# Altium project IoT_Hardware.PrjPcb
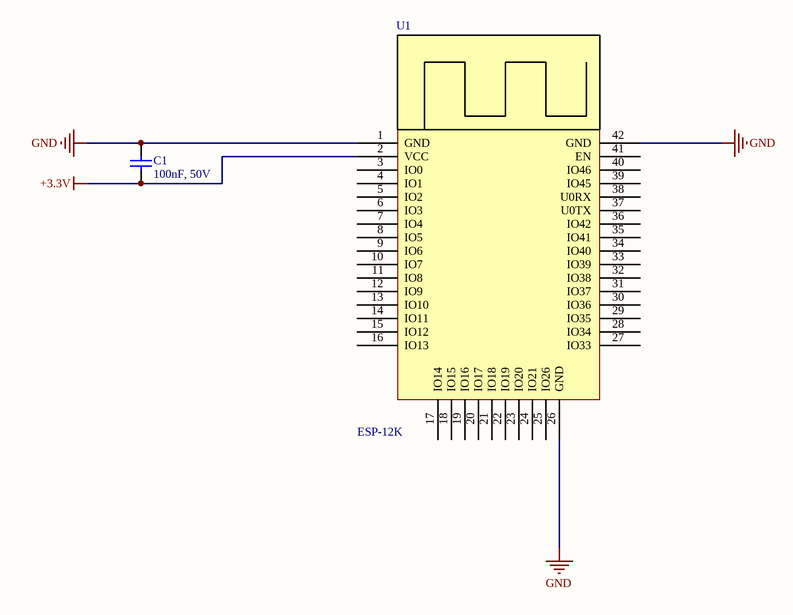
[diagram p0: 03_01_MCU_ESP32_Interface.SchDoc]
7 sheets, 51 parts. Net scope: flat (ports and power ports of the same name join across sheets).
Board file: v1.0.PcbDoc
Sheets:
  03_Top.SchDoc
  03_01_MCU_ESP32_Interface.SchDoc
  03_02_MCU_STM32F4_Interface.SchDoc
  04_Ethernet_Interface.SchDoc
  05_UART_Interface.SchDoc
  06_Power_Supply.SchDoc
  07_IO.SchDoc

## Sheet 03_Top.SchDoc
size A4; SheetNumber: 3; SheetTotal: 7

## Sheet 03_01_MCU_ESP32_Interface.SchDoc
size A4; SheetNumber: 4; SheetTotal: 9

### Parts
C1  100nF, 50V  [WCAP-CSGP_0603_H=0.8mm_Reflow]
U1  ESP-12K  [CAC-150P3100X1800-41N]

### Nets
+3.3V: C1.1 U1.2(VCC)
GND: C1.2 U1.1(GND) U1.26(GND) U1.42(GND)

Not connected (* = marked no-connect by the designer): U1 3(IO0) 4(IO1) 5(IO2) 6(IO3) 7(IO4) 8(IO5) 9(IO6) 10(IO7) 11(IO8) 12(IO9) 13(IO10) 14(IO11) 15(IO12) 16(IO13) 17(IO14) 18(IO15) 19(IO16) 20(IO17) 21(IO18) 22(IO19) 23(IO20) 24(IO21) 25(IO26) 27(IO33) 28(IO34) 29(IO35) 30(IO36) 31(IO37) 32(IO38) 33(IO39) 34(IO40) 35(IO41) 36(IO42) 37(U0TX) 38(U0RX) 39(IO45) 40(IO46) 41(EN)

### Library data of the parts
C1 = 885012206095: WCAP-CSGP Multilayer Ceramic Chip Capacitor, General Purpose, size 0603, X7R, 100nF, 50V; Manufacturer: Wurth Elektronik; Rated Voltage: 50VDC; Isolation Resistance: >=5GOhm; Capacitance Tolerance: +/-10%; Technical Reference: X7R0603104K050DFCT10000; ComponentLink1Description: Manufacturer; ComponentLink1URL: http://www.we-online.de; ComponentLink2Description: Datasheet; ComponentLink2URL: https://www.we-online.com/catalog/datasheet/885012206095.pdf; Operating Temperature: -55 to +125degC; Packaging: Tape and Reel; Manufacturer Part Number: 885012206095; Published Date: May 2020; Ceramic Type: X7R; Dissipation Factor: =<3%; Height: 0.8mm; Mounting Technology: SMT; Size: 0603; Capacitance: 100nF
U1 = ESP-12K: ESP32-S2

## Sheet 03_02_MCU_STM32F4_Interface.SchDoc
size A4; SheetNumber: 5; SheetTotal: 9
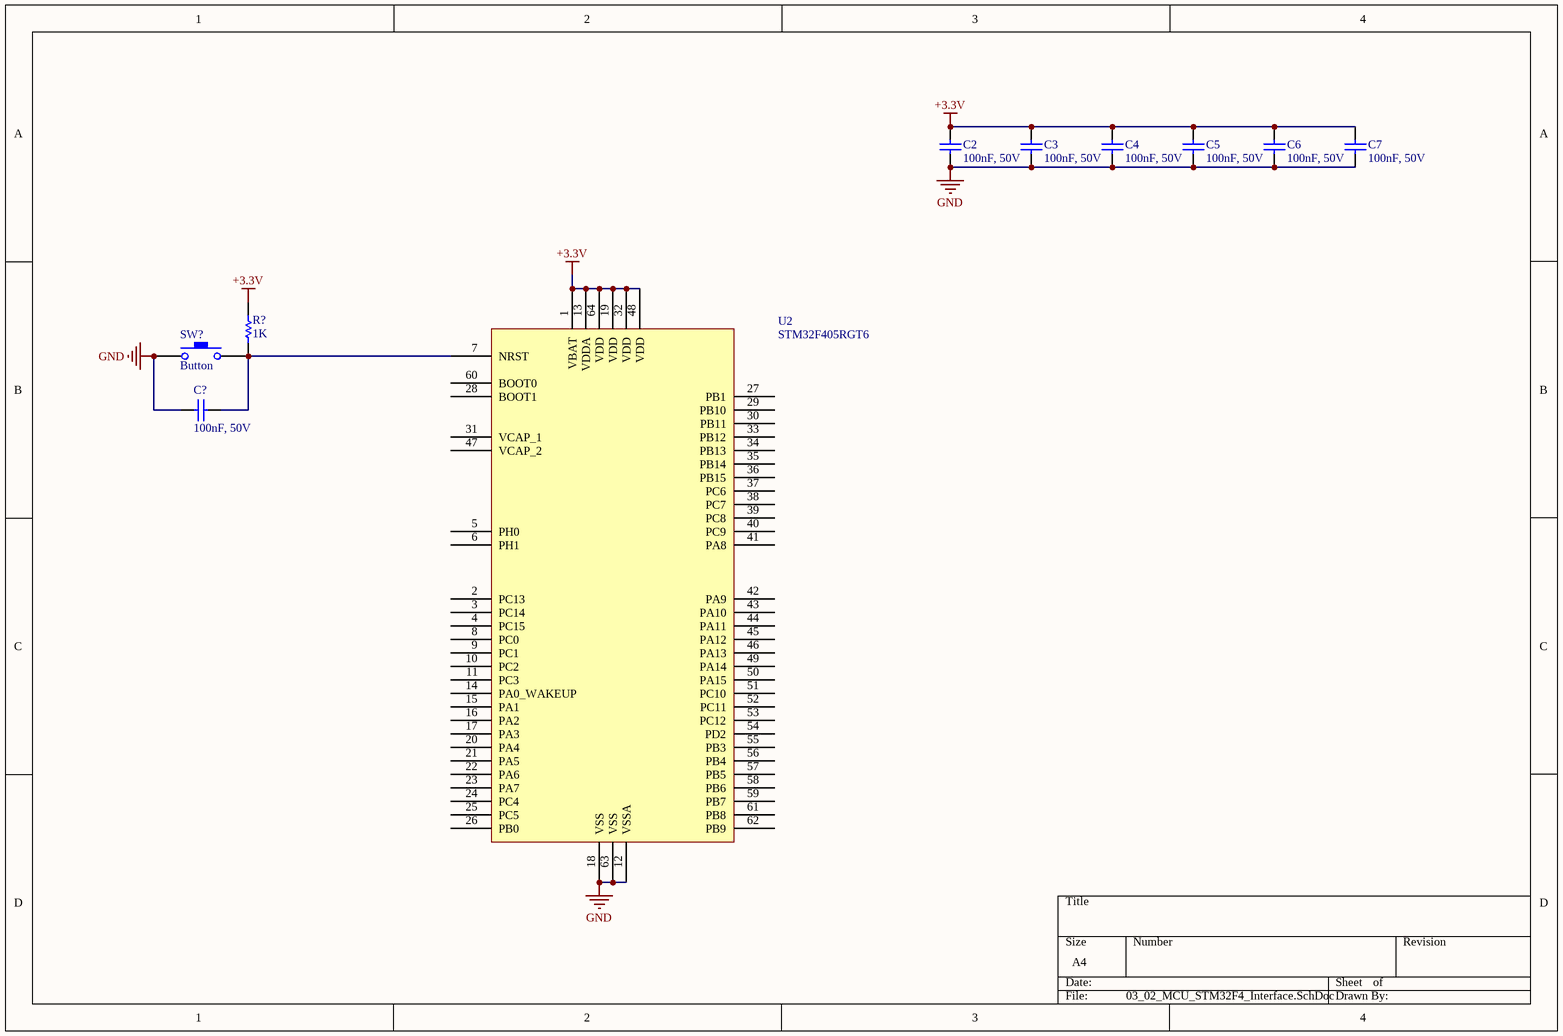
[diagram p1: 03_02_MCU_STM32F4_Interface.SchDoc]

### Parts
C2  100nF, 50V  [WCAP-CSGP_0603_H=0.8mm_Reflow]
C3  100nF, 50V  [WCAP-CSGP_0603_H=0.8mm_Reflow]
C4  100nF, 50V  [WCAP-CSGP_0603_H=0.8mm_Reflow]
C5  100nF, 50V  [WCAP-CSGP_0603_H=0.8mm_Reflow]
C6  100nF, 50V  [WCAP-CSGP_0603_H=0.8mm_Reflow]
C7  100nF, 50V  [WCAP-CSGP_0603_H=0.8mm_Reflow]
C?  100nF, 50V  [WCAP-CSGP_0603_H=0.8mm_Reflow]
R?  value 1K  [RES-SM-0603]  (hidden comment: RESISTOR SMD)
SW?  Button  [Button 4-pin SMD]
U2  STM32F405RGT6  [CQFP50P1150X1150X160-64N]

### Nets
+3.3V: C2.2 C3.2 C4.2 C5.2 C6.2 C7.2 R?.2 U2.1(VBAT) U2.13(VDDA) U2.19(VDD) U2.32(VDD) U2.48(VDD) U2.64(VDD)
GND: C2.1 C3.1 C4.1 C5.1 C6.1 C7.1 C?.1 SW?.1 U2.12(VSSA) U2.18(VSS) U2.63(VSS)
NetC?_2: C?.2 R?.1 SW?.2 U2.7(NRST)

Not connected (* = marked no-connect by the designer): U2 2(PC13) 3(PC14) 4(PC15) 5(PH0) 6(PH1) 8(PC0) 9(PC1) 10(PC2) 11(PC3) 14(PA0_WAKEUP) 15(PA1) 16(PA2) 17(PA3) 20(PA4) 21(PA5) 22(PA6) 23(PA7) 24(PC4) 25(PC5) 26(PB0) 27(PB1) 28(BOOT1) 29(PB10) 30(PB11) 31(VCAP_1) 33(PB12) 34(PB13) 35(PB14) 36(PB15) 37(PC6) 38(PC7) 39(PC8) 40(PC9) 41(PA8) 42(PA9) 43(PA10) 44(PA11) 45(PA12) 46(PA13) 47(VCAP_2) 49(PA14) 50(PA15) 51(PC10) 52(PC11) 53(PC12) 54(PD2) 55(PB3) 56(PB4) 57(PB5) 58(PB6) 59(PB7) 60(BOOT0) 61(PB8) 62(PB9)

### Library data of the parts
C2-C7 C? = 885012206095: as C1 on sheet 03_01_MCU_ESP32_Interface; ComponentLink1Description: Manufacturer; ComponentLink1URL: http://www.we-online.de; ComponentLink2Description: Datasheet; ComponentLink2URL: https://www.we-online.com/catalog/datasheet/885012206095.pdf; Operating Temperature: -55 to +125degC; Packaging: Tape and Reel; Manufacturer Part Number: 885012206095; Published Date: May 2020; Ceramic Type: X7R; Dissipation Factor: =<3%; Height: 0.8mm; Mounting Technology: SMT; Size: 0603; Capacitance: 100nF
R? = RESISTOR SMD: Resistor
U2 = STM32F405RGT6: Manufacturer: ST; ComponentLink1Description: Supplier 1 Link

## Sheet 04_Ethernet_Interface.SchDoc
size A4; SheetNumber: 4; SheetTotal: 7

## Sheet 05_UART_Interface.SchDoc
size A4; SheetNumber: 7; SheetTotal: 9
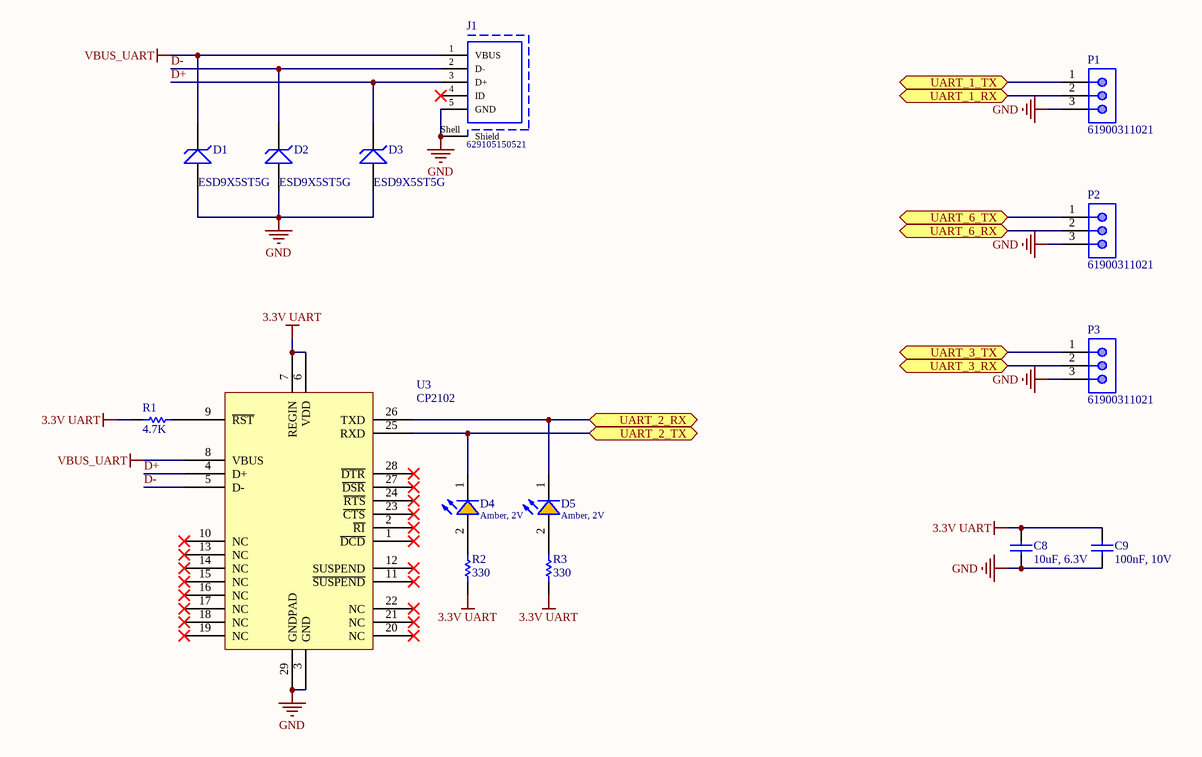
[diagram p2: 05_UART_Interface.SchDoc]

### Parts
C8  10uF, 6.3V  [WCAP-CSGP_0603_H=0.8mm_Reflow]
C9  100nF, 10V  [WCAP-CSGP_0603_H=0.8mm_Reflow]
D1  ESD9X5ST5G  [SODFL100X40-2N]
D2  ESD9X5ST5G  [SODFL100X40-2N]
D3  ESD9X5ST5G  [SODFL100X40-2N]
D4  Amber, 2V  [WL-SMCW_0603_H=0.7mm]
D5  Amber, 2V  [WL-SMCW_0603_H=0.7mm]
J1  629105150521  [629105150521]
P1  61900311021  [61900311021]
P2  61900311021  [61900311021]
P3  61900311021  [61900311021]
R1  value 4.7K  [RES-SM-0603]  (hidden comment: RESISTOR SMD)
R2  value 330  [RES-SM-0603]  (hidden comment: RESISTOR SMD)
R3  value 330  [RES-SM-0603]  (hidden comment: RESISTOR SMD)
U3  CP2102  [QFN50P500X500X90_HS-29N]

### Ports
UART_1_RX (bidir), UART_1_TX (bidir), UART_2_RX (bidir), UART_2_TX (bidir), UART_3_RX (bidir), UART_3_TX (bidir), UART_6_RX (bidir), UART_6_TX (bidir)

### Nets
3.3V UART: C8.2 C9.2 R1.2 R2.2 R3.2 U3.6(VDD) U3.7(REGIN)
GND: C8.1 C9.1 D1.2 D2.2 D3.2 J1.5(GND) J1.Shell(Shield) P1.3 P2.3 P3.3 U3.3(GND) U3.29(GNDPAD)
VBUS_UART: D1.1 J1.1(VBUS) U3.8(VBUS)
D+: D3.1 J1.3(D+) U3.4(D+)
D-: D2.1 J1.2(D-) U3.5(D-)
NetD4_1: D4.1(K) U3.25(RXD) ; port UART_2_TX
NetD4_2: D4.2(A) R2.1
NetD5_1: D5.1(K) U3.26(TXD) ; port UART_2_RX
NetD5_2: D5.2(A) R3.1
NetP1_1: P1.1 ; port UART_1_TX
NetP1_2: P1.2 ; port UART_1_RX
NetP2_1: P2.1 ; port UART_6_TX
NetP2_2: P2.2 ; port UART_6_RX
NetP3_1: P3.1 ; port UART_3_TX
NetP3_2: P3.2 ; port UART_3_RX
NetR1_1: R1.1 U3.9(~{RST})

Not connected (* = marked no-connect by the designer): J1 4(ID)*; U3 1(~{DCD})* 2(~{RI})* 10(NC)* 11(~{SUSPEND})* 12(SUSPEND)* 13(NC)* 14(NC)* 15(NC)* 16(NC)* 17(NC)* 18(NC)* 19(NC)* 20(NC)* 21(NC)* 22(NC)* 23(~{CTS})* 24(~{RTS})* 27(~{DSR})* 28(~{DTR})*

### Library data of the parts
C8 = 885012106006: WCAP-CSGP Multilayer Ceramic Chip Capacitor, General Purpose, size 0603, X5R, 10uF, 6.3V; Manufacturer: Wurth Elektronik; Rated Voltage: 6.3VDC; Isolation Resistance: >=0.01GOhm; Capacitance Tolerance: +/-20%; Technical Reference: X5R0603106M6R3DFCT10000; ComponentLink1Description: Manufacturer; ComponentLink1URL: http://www.we-online.de; ComponentLink2Description: Datasheet; ComponentLink2URL: https://www.we-online.com/catalog/datasheet/885012106006.pdf; Operating Temperature: -55 to +85degC; Packaging: Tape and Reel; Manufacturer Part Number: 885012106006; Published Date: May 2020; Ceramic Type: X5R; Dissipation Factor: =<10%; Height: 0.8mm; Mounting Technology: SMT; Size: 0603; Capacitance: 10uF
C9 = 885012206020: WCAP-CSGP Multilayer Ceramic Chip Capacitor, General Purpose, size 0603, X7R, 100nF, 10V; Manufacturer: Wurth Elektronik; Rated Voltage: 10VDC; Isolation Resistance: >=5GOhm; Capacitance Tolerance: +/-10%; Technical Reference: X7R0603104K010DFCT10000; ComponentLink1Description: Manufacturer; ComponentLink1URL: http://www.we-online.de; ComponentLink2Description: Datasheet; ComponentLink2URL: https://www.we-online.com/catalog/datasheet/885012206020.pdf; Operating Temperature: -55 to +125degC; Packaging: Tape and Reel; Manufacturer Part Number: 885012206020; Published Date: May 2020; Ceramic Type: X7R; Dissipation Factor: =<5%; Height: 0.8mm; Mounting Technology: SMT; Size: 0603; Capacitance: 100nF
D1-D3 = ESD9X5ST5G: Manufacturer: ON Semiconductor; Manufacturer P/N: ESD9X3.3ST5G; ComponentLink1Description: Supplier 1 Link; ComponentLink1URL: https://www.mouser.com/ProductDetail/ON-Semiconductor/ESD9X33ST5G/?qs=OSf9jACorvbAKluOtJV5Vg%3D%3D; Supplier 1: Mouser; Supplier 1 P/N: 863-ESD9X3.3ST5G
D4 D5 = 150060AS75000: WL-SMCW SMT Mono-color Chip LED Waterclear, size 0603, Amber, 2V, 140deg; Chip Technology: AlInGaP; Dominant Wavelength typ.: 605nm; Luminous Intensity typ.: 130mcd; Peak Wavelength typ.: 610nm; Viewing Angle: 140deg; ComponentLink1Description: Manufacturer; ComponentLink1URL: http://www.we-online.de; ComponentLink2URL: https://www.we-online.com/catalog/datasheet/150060AS75000.pdf; ComponentLink2Description: Datasheet; Forward Voltage typ.: 2V; Emitting Color: Amber; Mounting Technology: SMT; Operating Temperature: -40 to +85degC; Published Date: December 2019; Part Number: 150060AS75000; Packaging: Tape and Reel; Size: 0603; Publisher: Wurth Elektronik
J1 = 629105150521: Micro USB 2.0 Type B Receptacle WR-COM, Horizontal, SMT, with Pegs, High Current at Pin 1 & Pin 5; Rated Current: 3 A; Contact Resistance: 30 mOhm; Working Voltage: 30 VAC; ComponentLink1Description: Manufacturer; ComponentLink1URL: http://www.we-online.de; ComponentLink2Description: Datasheet; ComponentLink2URL: https://katalog.we-online.de/em/datasheet/629105150521.pdf; Part Number: 629105150521; Published Date: September 2018; Publisher: Wurth Elektronik; Orientation: Horizontal; Connector Type: Micro USB 2.0 Type B; Operating Temperature: -40 to 85 degC; Mounting Technology: SMT; Gender: Receptacle; Packaging: Tape and Reel
P1-P3 = 61900311021: WR-WTB THT Male Left Angled Bottom Locking Header, pitch 2.54mm, 3p; Pin Number: 3; Contact Resistance: 20mOhm; Rated Current: 3A; Withstanding Voltage: 1000VAC; Working Voltage: 250VAC; ComponentLink1Description: Manufacturer; ComponentLink1URL: http://www.we-online.de; ComponentLink2Description: Datasheet; ComponentLink2URL: https://www.we-online.com/catalog/datasheet/61900311021.pdf; Pitch: 2.54mm; Published Date: January 2020; Publisher: Wurth Elektronik; Mounting Technology: THT; Packaging: Bag; Operating Temperature: -40 to +105degC; Part Number: 61900311021; Gender: Male; Type: Right Angled Bottom Locking
R1-R3 = RESISTOR SMD: Resistor

## Sheet 06_Power_Supply.SchDoc
size A4; SheetNumber: 8; SheetTotal: 9
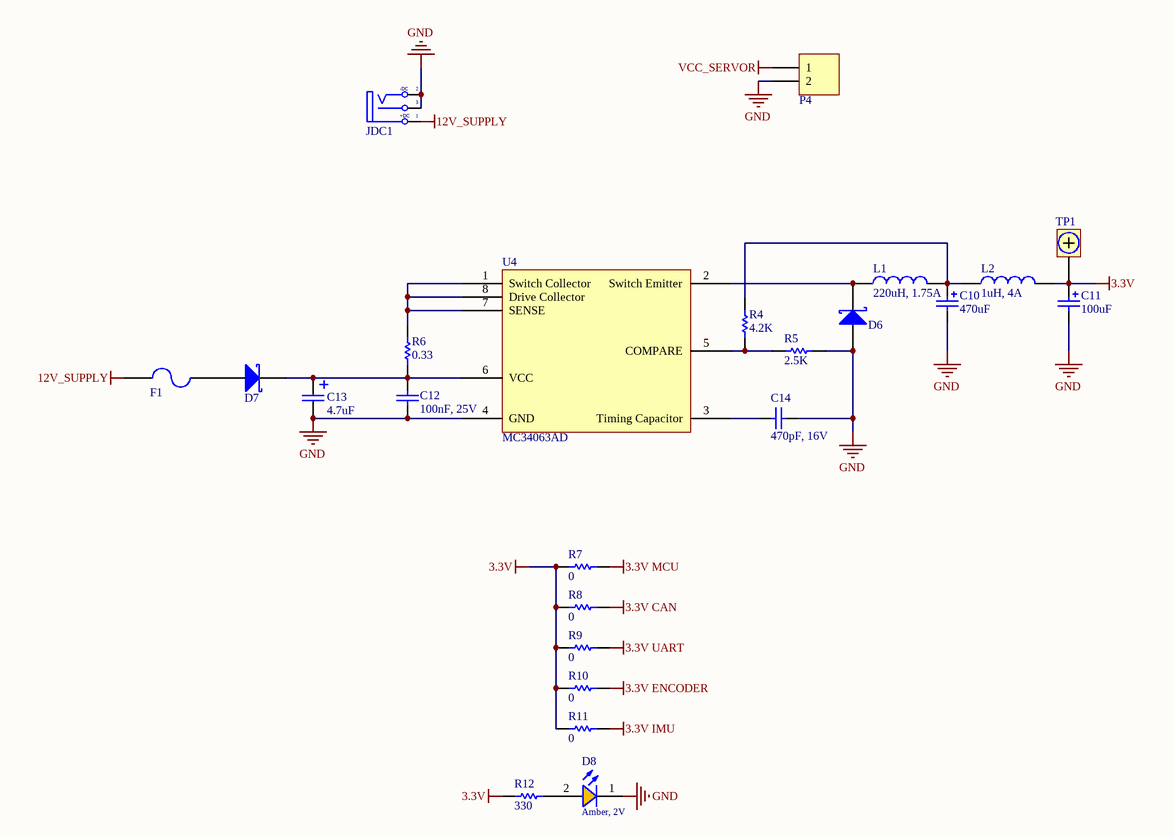
[diagram p3: 06_Power_Supply.SchDoc]

### Parts
C10  value 470uF  [CAP ALU SIZE F]  (hidden comment: Cap Pol SMD)
C11  value 100uF  [CAP ALU SIZE D]  (hidden comment: Cap Pol SMD)
C12  100nF, 25V  [WCAP-CSGP_0603_H=0.8mm_Reflow]
C13  value 4.7uF  [CAPMP3216X18N]  (hidden comment: Tantalum Capacitor)
C14  470pF, 16V  [WCAP-CSGP_0603_H=0.8mm_Reflow]
D6  D Schottky  [SS34]  (value not drawn)
D7  D Schottky  [SS34]  (value not drawn)
D8  Amber, 2V  [WL-SMCW_0603_H=0.7mm]
F1  Fuse  [FUSE SMD]  (value not drawn)
JDC1  Jack DC  [DC-IN]  (value not drawn)
L1  220uH, 1.75A  [WE-PD2A_5848]
L2  1uH, 4A  [WE-PD2A_4532]
P4  Domino 2  [DOMINO 2- 5mm]  (value not drawn)
R4  value 4.2K  [RES-SM-0603]  (hidden comment: RESISTOR SMD)
R5  value 2.5K  [RES-SM-0603]  (hidden comment: RESISTOR SMD)
R6  value 0.33  [RES-SM-0805]  (hidden comment: RESISTOR SMD)
R7  value 0  [RES-SM-0805]  (hidden comment: RESISTOR SMD)
R8  value 0  [RES-SM-0805]  (hidden comment: RESISTOR SMD)
R9  value 0  [RES-SM-0805]  (hidden comment: RESISTOR SMD)
R10  value 0  [RES-SM-0805]  (hidden comment: RESISTOR SMD)
R11  value 0  [RES-SM-0805]  (hidden comment: RESISTOR SMD)
R12  value 330  [RES-SM-0603]  (hidden comment: RESISTOR SMD)
TP1  Test point  [TP]  (value not drawn)
U4  MC34063AD  [SOIC127P600X170-8N]

### Nets
3.3V: C11.1 L2.2 R7.2 R8.2 R9.2 R10.2 R11.2 R12.2 TP1.1
3.3V CAN: R8.1
3.3V ENCODER: R10.1
3.3V IMU: R11.1
3.3V MCU: R7.1
3.3V UART: R9.1
12V_SUPPLY: F1.1 JDC1.1(T)
GND: C10.2 C11.2 C12.1 C13.2 C14.2 D6.1(A) D8.1(K) JDC1.2(TN) JDC1.3(S) P4.2 R5.1 U4.4(GND)
VCC_SERVOR: P4.1
NetC10_1: C10.1 L1.2 L2.1 R4.2
NetC12_2: C12.2 C13.1 D7.2(K) R6.1 U4.6(VCC)
NetC14_1: C14.1 U4.3(Timing_Capacitor)
NetD6_2: D6.2(K) L1.1 U4.2(Switch_Emitter)
NetD7_1: D7.1(A) F1.2
NetD8_2: D8.2(A) R12.1
NetR4_1: R4.1 R5.2 U4.5(COMPARE)
NetR6_2: R6.2 U4.1(Switch_Collector) U4.7(SENSE) U4.8(Drive_Collector)

### Notes on the sheet
- (in symbol Jack DC) -DC; +DC

### Library data of the parts
C10 C11 = Cap Pol SMD: Polarized Capacitor (Radial)
C12 = 885012206071: WCAP-CSGP Multilayer Ceramic Chip Capacitor, General Purpose, size 0603, X7R, 100nF, 25V; Manufacturer: Wurth Elektronik; Rated Voltage: 25VDC; Isolation Resistance: >=5GOhm; Capacitance Tolerance: +/-10%; Technical Reference: X7R0603104K025DFCT10000; ComponentLink1Description: Manufacturer; ComponentLink1URL: http://www.we-online.de; ComponentLink2Description: Datasheet; ComponentLink2URL: https://www.we-online.com/catalog/datasheet/885012206071.pdf; Operating Temperature: -55 to +125degC; Packaging: Tape and Reel; Manufacturer Part Number: 885012206071; Published Date: May 2020; Ceramic Type: X7R; Dissipation Factor: =<3.5%; Height: 0.8mm; Mounting Technology: SMT; Size: 0603; Capacitance: 100nF
C14 = 885012006027: WCAP-CSGP Multilayer Ceramic Chip Capacitor, General Purpose, size 0603, NP0, 470pF, 16V; Manufacturer: Wurth Elektronik; Rated Voltage: 16VDC; Isolation Resistance: >=10GOhm; Capacitance Tolerance: +/-5%; Dissipation Factor: Q>=1000; Technical Reference: NP00603471J016DFCT10000; ComponentLink1Description: Manufacturer; ComponentLink1URL: http://www.we-online.de; ComponentLink2Description: Datasheet; ComponentLink2URL: https://www.we-online.com/catalog/datasheet/885012006027.pdf; Operating Temperature: -55 to +125degC; Packaging: Tape and Reel; Manufacturer Part Number: 885012006027; Published Date: May 2020; Ceramic Type: NP0; Height: 0.8mm; Mounting Technology: SMT; Size: 0603; Capacitance: 470pF
D6 D7 = D Schottky: Schottky Diode; Published: 8-Jun-2000; LatestRevisionDate: 17-Jul-2002; LatestRevisionNote: Re-released for DXP Platform.; PackageReference: SMB; Publisher: Altium Limited; PackageDescription: DO-214-AA/SMB; 2 C-Bend Leads; Body 5.3 x 3.6 mm, inc. leads (LxW); Code_JEDEC: DO-214-AA
D8 = 150060AS75000: as D4 on sheet 05_UART_Interface; Viewing Angle: 140deg; ComponentLink1Description: Manufacturer; ComponentLink1URL: http://www.we-online.de; ComponentLink2URL: https://www.we-online.com/catalog/datasheet/150060AS75000.pdf; ComponentLink2Description: Datasheet; Forward Voltage typ.: 2V; Emitting Color: Amber; Mounting Technology: SMT; Operating Temperature: -40 to +85degC; Published Date: December 2019; Part Number: 150060AS75000; Packaging: Tape and Reel; Size: 0603; Publisher: Wurth Elektronik
JDC1 = Jack DC: Jack DC input; Value: Jac DC
L1 = 784774222: WE-PD2A SMT Power Inductor, size 5848, 220uH, 0.41A; Manufacturer: Wurth Elektronik; DC Resistance max.: 1.57Ohm; Saturation Current: 0.47A; Self Resonant Frequency: 5MHz; DC Resistance typ.: 0.945Ohm; Rated Voltage: 80VDC; ComponentLink1Description: Manufacturer; ComponentLink1URL: http://www.we-online.de; ComponentLink2Description: Datasheet; ComponentLink2URL: https://www.we-online.com/catalog/datasheet/784774222.pdf; Manufacturer Part Number: 784774222; Published Date: May 2020; Rated Current: 0.41A; Inductance: 220uH; Operating Temperature: -40 to +125degC; Mounting Technology: SMT; Packaging: Tape and Reel; Size: 5848
L2 = 7847730: WE-PD2A SMT Power Inductor, size 4532, 1uH, 4A; Manufacturer: Wurth Elektronik; DC Resistance max.: 0.049Ohm; Saturation Current: 5.72A; Self Resonant Frequency: 110MHz; DC Resistance typ.: 0.014Ohm; Rated Voltage: 80VDC; ComponentLink1Description: Manufacturer; ComponentLink1URL: http://www.we-online.de; ComponentLink2Description: Datasheet; ComponentLink2URL: https://www.we-online.com/catalog/datasheet/7847730.pdf; Manufacturer Part Number: 7847730; Published Date: May 2020; Rated Current: 4A; Inductance: 1uH; Operating Temperature: -40 to +125degC; Mounting Technology: SMT; Packaging: Tape and Reel; Size: 4532
P4 = Domino 2: Domino, 2-Pin; LatestRevisionDate: 17-Jul-2002; LatestRevisionNote: Re-released for DXP Platform.; Publisher: Altium Limited
R4-R12 = RESISTOR SMD: Resistor
TP1 = TP: ComponentLink1Description: Supplier 1 Link
U4 = MC34063: 1.5-A boost, buck, inverting switching regulator, operation from 0°C to 70°C; Manufacturer: Texas Instruments; ComponentLink1Description: Local Supplier Link; ComponentLink1URL: https://www.thegioiic.com/products/mc34063ad-ic-dieu-chinh-tang-giam-ap-1-5a-8-soic; Local Supplier: Thegioiic; Local Supplier P/N: MC34063AD; Manufacturer P/N: MC34063AD

## Sheet 07_IO.SchDoc
size A4; SheetNumber: 7; SheetTotal: 7

## Nets that join several sheets
3.3V UART: 05_UART_Interface (7 pins), 06_Power_Supply (R9.1)
+3.3V: 03_01_MCU_ESP32_Interface (C1.1 U1.2), 03_02_MCU_STM32F4_Interface (13 pins)
GND: 03_01_MCU_ESP32_Interface (C1.2 U1.1 U1.26 U1.42), 03_02_MCU_STM32F4_Interface (11 pins), 05_UART_Interface (12 pins), 06_Power_Supply (12 pins)